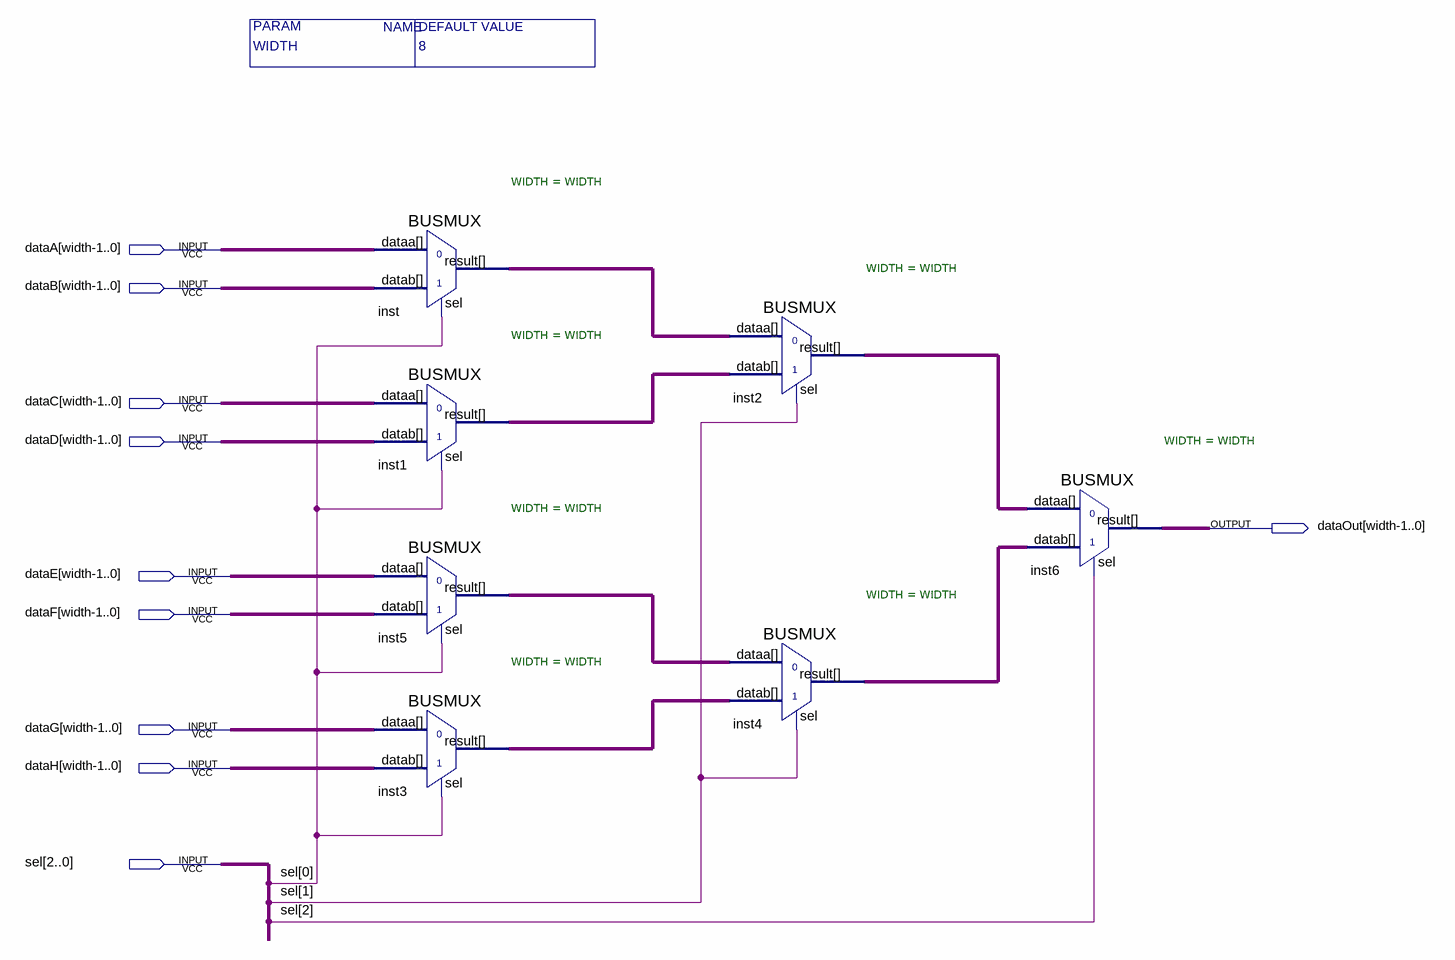
[diagram p0: schematic sheet]
// Quartus schematic wb_block_busMux_8-1.bdf as structural Verilog: 7 symbols, 10 pins
module \wb_block_busMux_8-1  #(parameter WIDTH = 8) (
  input  [7:0] dataA,
  input  [7:0] dataB,
  input  [7:0] dataC,
  input  [7:0] dataD,
  input  [7:0] dataE,
  input  [7:0] dataF,
  input  [7:0] dataG,
  input  [7:0] dataH,
  input  [2:0] sel,
  output [7:0] dataOut
);

  wire [7:0] inst1_result, inst2_result, inst3_result, inst4_result, inst5_result, inst_result;

  BUSMUX #(.WIDTH(WIDTH)) inst (.datab(dataB), .sel(sel[0]), .dataa(dataA), .result(inst_result));
  BUSMUX #(.WIDTH(WIDTH)) inst1 (.datab(dataD), .sel(sel[0]), .dataa(dataC), .result(inst1_result));
  BUSMUX #(.WIDTH(WIDTH)) inst5 (.datab(dataF), .sel(sel[0]), .dataa(dataE), .result(inst5_result));
  BUSMUX #(.WIDTH(WIDTH)) inst3 (.datab(dataH), .sel(sel[0]), .dataa(dataG), .result(inst3_result));
  BUSMUX #(.WIDTH(WIDTH)) inst2 (.datab(inst1_result), .sel(sel[1]), .dataa(inst_result), .result(inst2_result));
  BUSMUX #(.WIDTH(WIDTH)) inst4 (.datab(inst3_result), .sel(sel[1]), .dataa(inst5_result), .result(inst4_result));
  BUSMUX #(.WIDTH(WIDTH)) inst6 (.datab(inst4_result), .sel(sel[2]), .dataa(inst2_result), .result(dataOut));
endmodule
